# EAGLE design espism-v3 (EAGLE 6.5.0)
CNAME: An ISM to Wifi gateway; CREVISION: 3; DESIGNER: Johan Kanflo
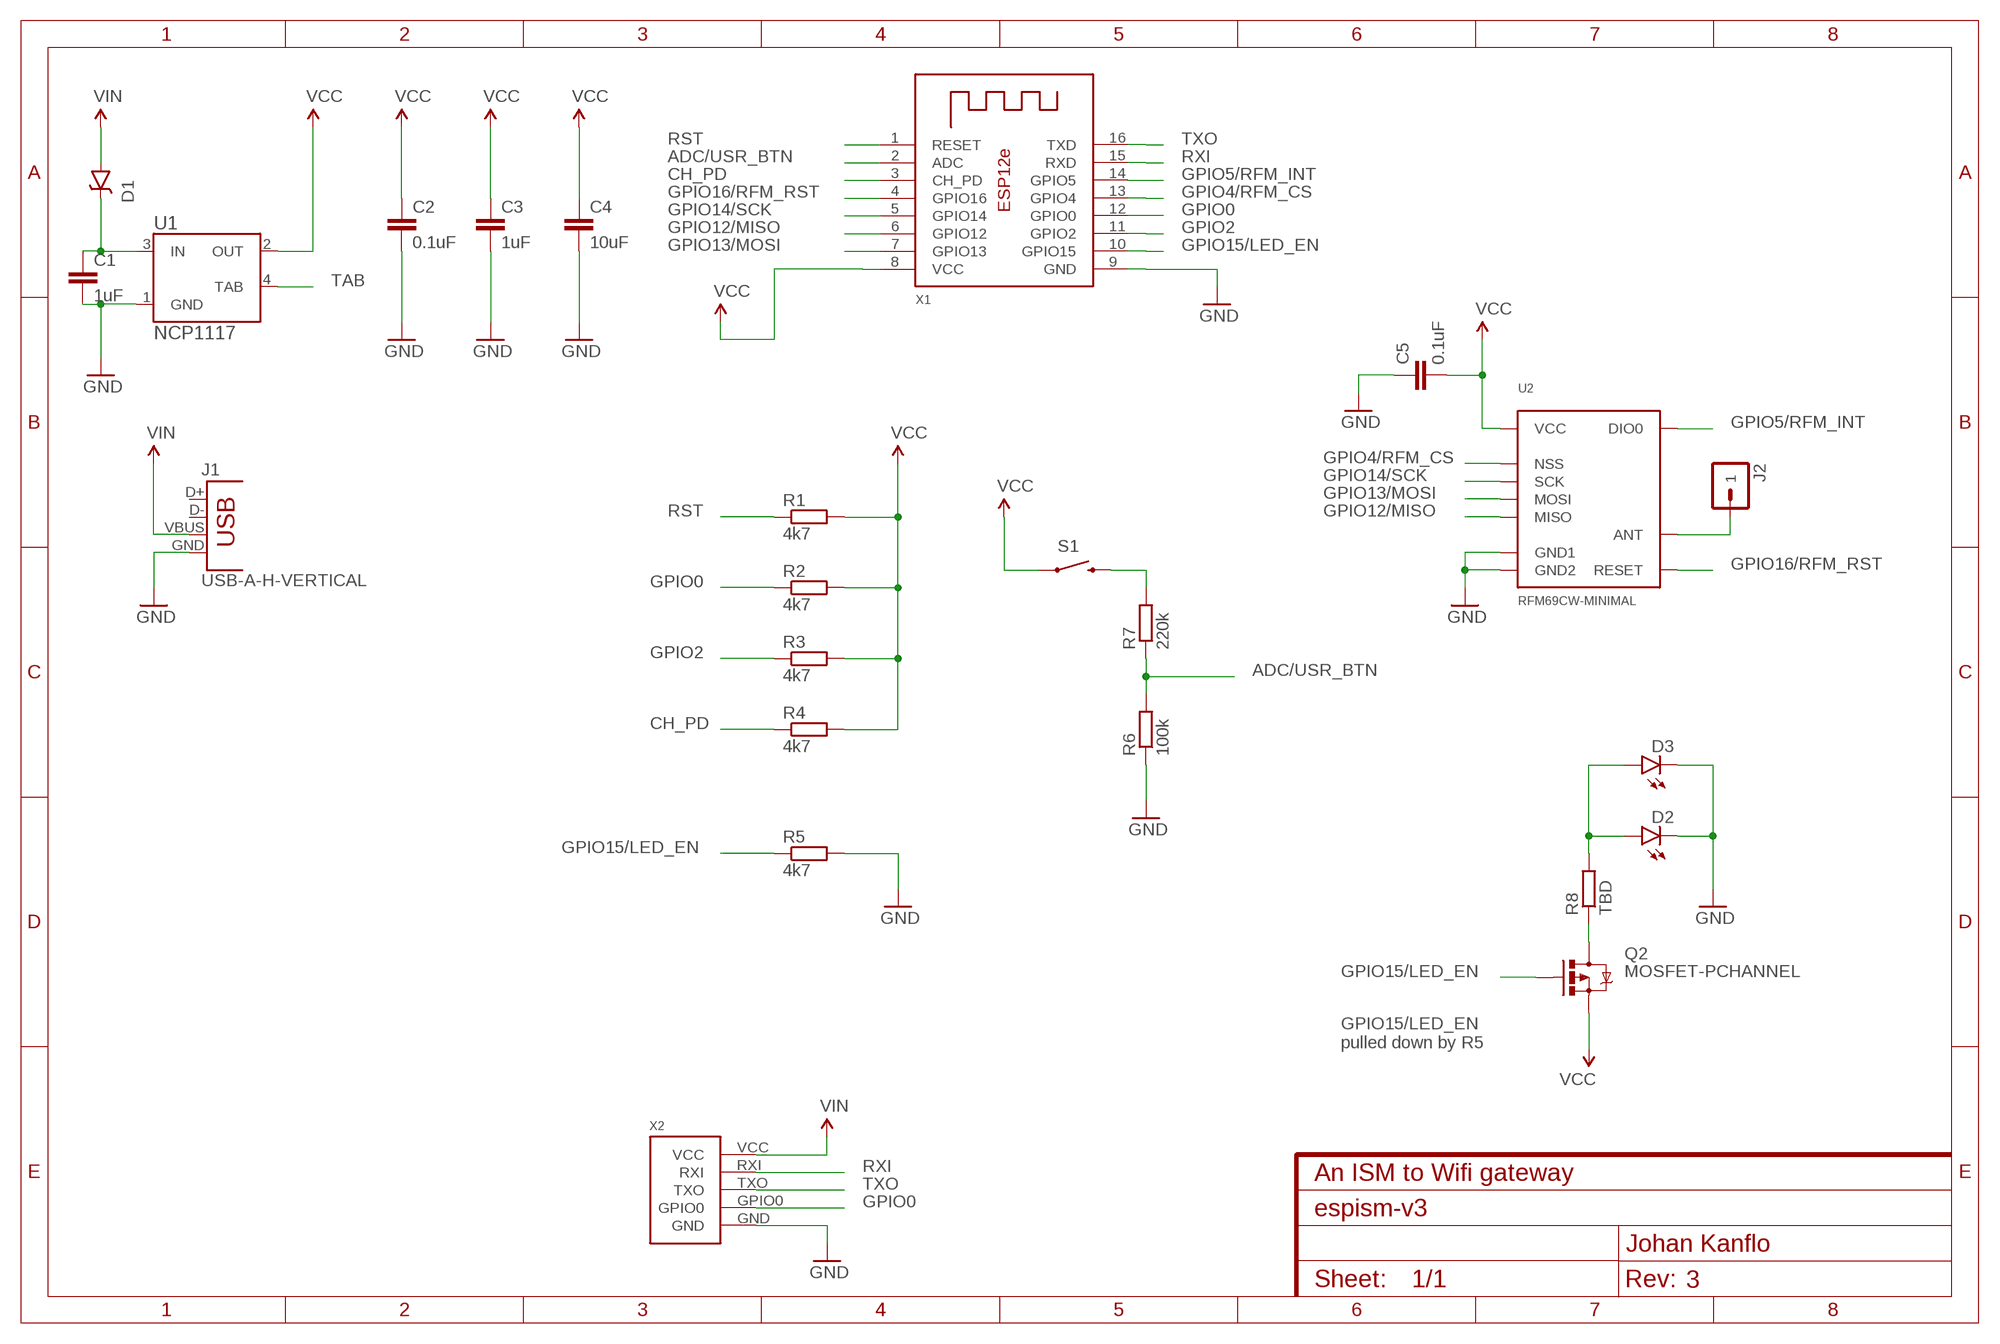
[diagram p0: schematic, sheet 1]

## Parts
C1  1uF  CAP0603-CAP  [0603-CAP]
C2  0.1uF  CAP0603-CAP  [0603-CAP]
C3  1uF  CAP0603-CAP  [0603-CAP]
C4  10uF  CAP0603-CAP  [0603-CAP]
C5  0.1uF  CAP0603-CAP  [0603-CAP]
D1  DIODE-SCHOTTKYSOD-123FL  [SOD-123FL]
D2  LED0603  [LED-0603]
D3  LED0603  [LED-0603]
J1  USB-A-H-VERTICAL  [USB-A-H-VERTICAL]
J2  M01-ANTENNA  [1X01-ANTENNA]
Q2  MOSFET-PCHANNEL  [SOT23-3]
R1  4k7  R-EU_R0603  [R0603]
R2  4k7  R-EU_R0603  [R0603]
R3  4k7  R-EU_R0603  [R0603]
R4  4k7  R-EU_R0603  [R0603]
R5  4k7  R-EU_R0603  [R0603]
R6  100k  R-EU_R0603  [R0603]
R7  220k  R-EU_R0603  [R0603]
R8  TBD  R-EU_R0603  [R0603]
S1  SWITCH-MOMENTARY-2SMD-1101NE  [TACTILE-SWITCH-1101NE]
U1  NCP1117  [SOT223]
U2  RFM69CW-MINIMAL  [RFM69CW-MINIMAL]
X1  ESP-12E  [ESP-12E]
X2  ESPROGESPROG-DEVICE  [ESPROG]

## Nets
ADC/USR_BTN: R6.2 R7.1 X1.2(ADC)
CAM_VCC: Q2.3(D) R8.1
CH_PD: R4.1 X1.3(CH_PD)
GND: C1.2 C2.2 C3.2 C4.2 C5.1 D2.C D3.C J1.GND R5.2 R6.1 U1.1(GND) U2.GND@1(GND1) U2.GND@2(GND2) X1.9(GND) X2.GND
GPIO0: R2.1 X1.12(GPIO0) X2.GPIO0
GPIO2: R3.1 X1.11(GPIO2)
GPIO4/RFM_CS: U2.NSS X1.13(GPIO4)
GPIO5/RFM_INT: U2.DIO0 X1.14(GPIO5)
GPIO12/MISO: U2.MISO X1.6(GPIO12)
GPIO13/MOSI: U2.MOSI X1.7(GPIO13)
GPIO14/SCK: U2.SCK X1.5(GPIO14)
GPIO15/LED_EN: Q2.1(G) R5.1 X1.10(GPIO15)
GPIO16/RFM_RST: U2.RESET X1.4(GPIO16)
N$1: D2.A D3.A R8.2
N$3: C1.1 D1.C U1.3(IN)
N$7: J2.1 U2.ANT
N$10: R7.2 S1.2
RST: R1.1 X1.1(RESET)
RXI: X1.15(RXD) X2.RXI
TAB: U1.4(TAB)
TXO: X1.16(TXD) X2.TXO
VCC: C2.1 C3.1 C4.1 C5.2 Q2.2(S) R1.2 R2.2 R3.2 R4.2 S1.1 U1.2(OUT) U2.VDD(VCC) X1.8(VCC)
VIN: D1.A J1.VBUS X2.VCC
Unconnected: J1.D+ J1.D-

## Notes on the sheet
- GPIO15/LED_EN
  pulled down by R5

## Library data of the parts
C1-C5 = SparkFun-Capacitors:CAP: Capacitor Standard 0603 ceramic capacitor, and 0.1" leaded capacitor.
D1 = kanflo:DIODE-SCHOTTKY
D2 D3 = SparkFun-LED:LED: LEDs Standard schematic elements and footprints for 5mm, 3mm, 1206, and 0603 sized LEDs. 5mm - Spark Fun Electronics SKU : COM-00529 (and others)
J1 = kanflo:USB: USB Connectors USB-A-H-VERTICAL a variant of SparkFun's USB-A-H (PRT-00437) that is mounted standing on the PCB. Bend the legs of the connector and solder in place. Solder header pins to the remaining holes to act as support for the connector.
J2 = kanflo:M01: Header 1 Standard 1-pin 0.1" header without silk screen.
Q2 = SparkFun-DiscreteSemi:MOSFET-PCHANNEL: Generic PMOSFET IRLML2244 - TRANS-11153 (SOT-23 -20V -4.3A) (1.Gate 2.Source 3.Drain) FQP27P06 - COM-10349 <http://www.sparkfun.com/products/10349> (TO-220 -60V -27A) (1.Gate 2.Source 3.Drain); PROD_ID: TRANS-08285
R1-R8 = resistor:R-EU_: RESISTOR, European symbol
S1 = SparkFun-Electromechanical:SWITCH-MOMENTARY-2: Various NO switches- pushbuttons, reed, etc; PROD_ID: SWCH-00815
U1 = ELL-i-PowerIC:NCP1117
U2 = kanflo:RFM69CW-MINIMAL: HopeRFs RFM69CW with all minimal IO.
X1 = kanflo:ESP-12E: ESP12e module This is a copy of AdaFruit's device with correct pin order for GPIO4 and GPIO5.
X2 = kanflo:ESPROG

## Board
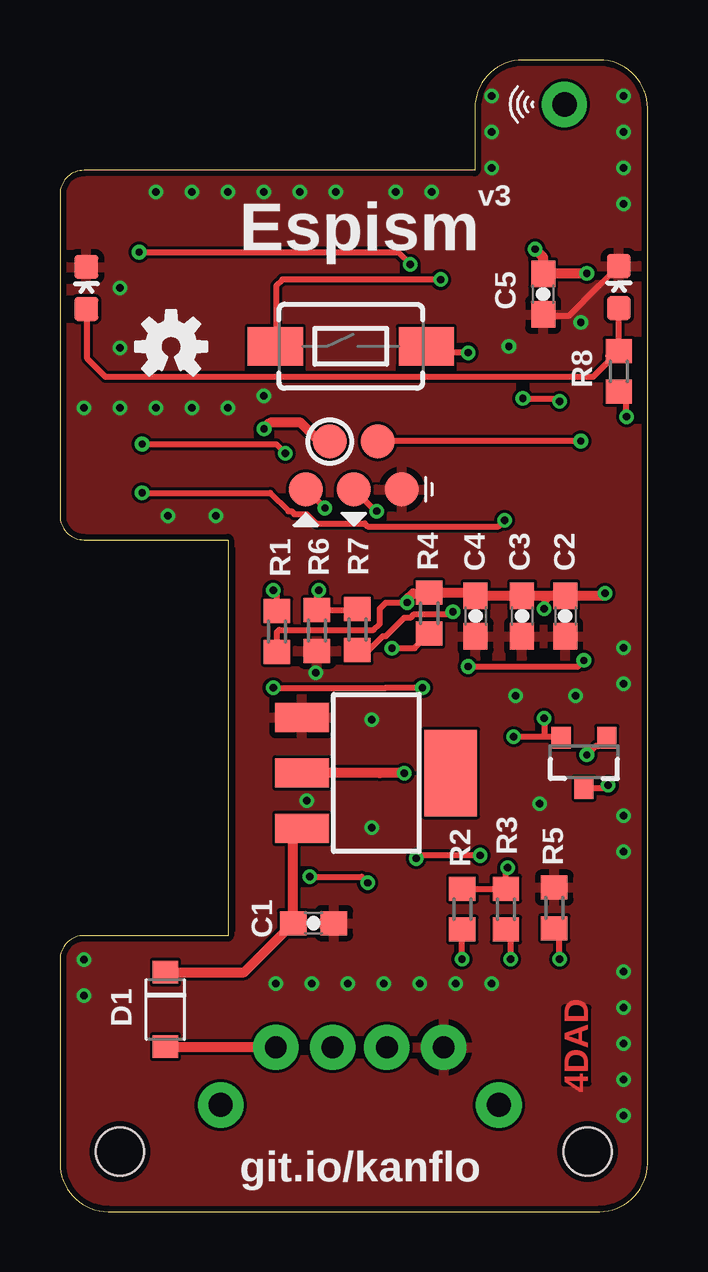
[diagram p1: board, top side]
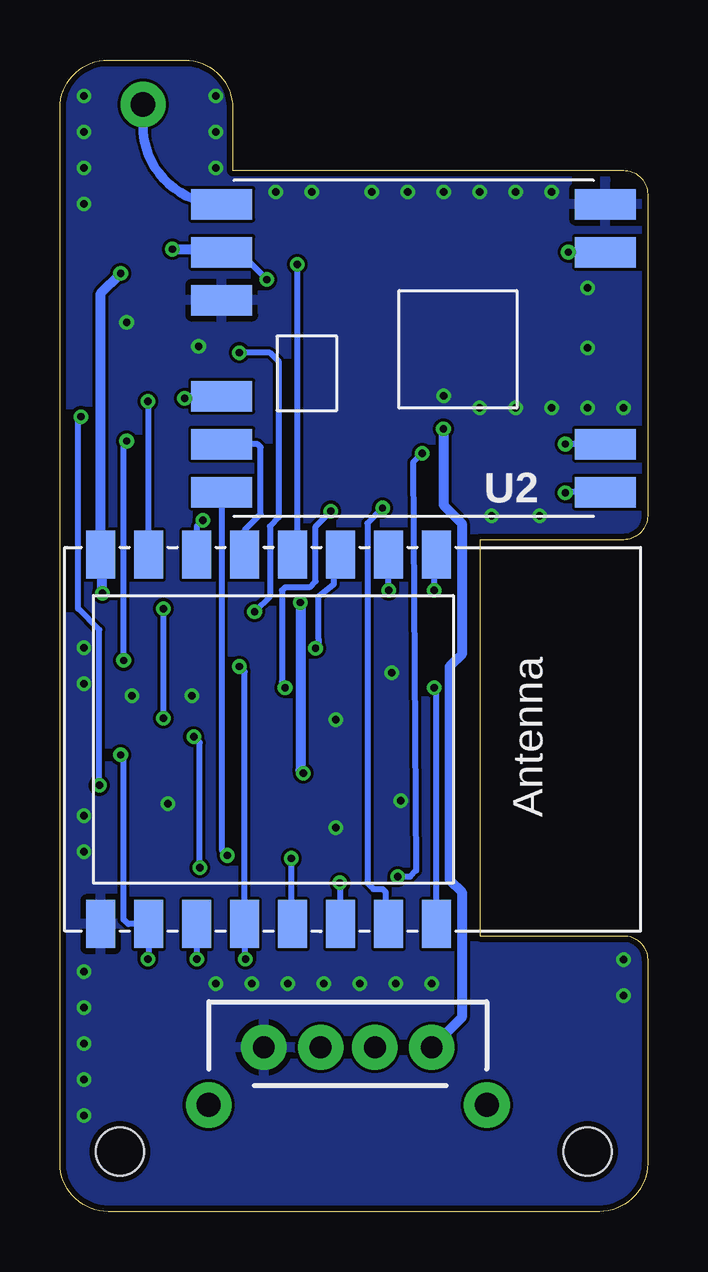
[diagram p2: board, bottom side, seen from below]

Size 24.5 x 48 mm. Coordinates in mm from the lower left corner, seen from the top.
Outline: 17.3,43.4 1,43.4 arc90 0,42.4 0,29 arc90 1,28 7,28 7,11.5 1,11.5 arc90 0,10.5 0,2 arc90 2,0 22.5,0 arc90 24.5,2 24.5,46 arc90 22.5,48 19.3,48 arc90 17.3,46 17.3,43.4
Copper layers (1*16): Top 0.035mm / dielectric 1.5mm / Bottom 0.035mm
Design rules "dirt_cheap_dirty_boards.v1": minimum track width 5mil, minimum drill 12mil, track to track 5mil, track to pad 5mil, pad to pad 5mil, via to via 5mil, smd to smd 0mil, copper to edge 10mil, drill to drill 10mil, minimum pad ring 10mil, minimum via ring 6mil, stop-mask expansion 2mil, vias tented up to drill 25mil, thermal gap 10mil
Holes 2 mm at 22,2.5 2.5,2.5

### Footprints (pad centres in the part's own frame; a part is rotated, then mirrored left to right if it is on the bottom)
0603-CAP = smd 1.1 x 1: 1 -0.85,0; 2 0.85,0
SOD-123FL = smd 0.95 x 1.05: A -1.6,0; C 1.5,0
LED-0603 = smd 1 x 1: A 0,-0.877; C 0,0.877
USB-A-H-VERTICAL = drill 0.914 pad 1.88: D+ 1.24,1.127; D- 1.24,-1.127; GND 1.24,3.5; VBUS 1.24,-3.5 | drill 1 pad 1.9: GND2 -1.16,-5.8; GND3 -1.16,5.8
1X01-ANTENNA = drill 1.016 pad 1.88: 1 0,0
SOT23-3 = smd 0.8 x 0.9: 1 -0.95,-1; 2 0.95,-1; 3 0,1.1
R0603 = smd 1 x 1.1: 1 -0.85,0; 2 0.85,0
TACTILE-SWITCH-1101NE = smd 2.3 x 1.6: 1 -3.15,0; 2 3.15,0
SOT223 = smd 1.219 x 2.235: 1 -2.311,-3.099; 2 0,-3.099; 3 2.311,-3.099 | smd 3.6 x 2.2: 4 0,3.099
RFM69CW-MINIMAL = smd 2.54 x 1.27: ANT 10.9,-6.1; DIO0 -5.1,3.9; GND@1 10.9,-2.1; GND@2 -5.1,-6.1; MISO -5.1,5.9; MOSI 10.9,1.9; NSS 10.9,5.9; RESET -5.1,-4.1; SCK 10.9,3.9; VDD 10.9,-4.1
ESP-12E = smd 2 x 1.2: 1 -7.7,4.5; 2 -7.7,2.5; 3 -7.7,0.5; 4 -7.7,-1.5; 5 -7.7,-3.5; 6 -7.7,-5.5; 7 -7.7,-7.5; 8 -7.7,-9.5; 9 7.7,-9.5; 10 7.7,-7.5; 11 7.7,-5.5; 12 7.7,-3.5; 13 7.7,-1.5; 14 7.7,0.5; 15 7.7,2.5; 16 7.7,4.5
ESPROG = smd 1.422 x 1.422: GND -1,-2; GPIO0 1,-1; RXI -1,2; TXO -1,0; VCC 1,1

### Placement (x,y rotation side)
C1  10.57,12.02 0 top
C2  21.07,24.82 270 top
C3  19.26,24.82 270 top
C4  17.32,24.82 270 top
C5  20.16,38.24 90 top
D1  4.39,8.48 90 top
D2  23.3,38.53 0 top
D3  1.1,38.5 0 top
J1  12.5,5.6 90 bottom
J2  21.04,46.15 135 top
Q2  21.85,18.75 180 top
R1  9.05,24.18 270 top
R2  16.78,12.6 90 top
R3  18.59,12.6 90 top
R4  15.39,24.94 90 top
R5  20.61,12.66 90 top
R6  10.72,24.22 90 top
R7  12.4,24.26 270 top
R8  23.3,35.02 90 top
S1  12.12,36.06 0 top
U1  13.19,18.28 270 top
U2  6.86,35.89 180 bottom
U$2  [OSHW-LOGO-S]  4.64,36.06 0 top
X1  13.3,19.68 270 bottom
X2  12.25,31.1 90 top

### Tracks (layer width: path | path; a pad name or v marks a point on that pad's centre or on a via)
ADC/USR_BTN  (via drill 0.3 pad 0.25)
  Top 0.254: v10.79,25.89 10.72,25.81 R6.2 12.36,25.07 R7.1
  Bottom 0.254: v10.79,25.89 X1.2
CAM_VCC  (via drill 0.3 pad 0.25)
  Top 0.254: Q2.3 22.75,17.65 v22.86,17.77 | v23.62,33.13 23.62,33.85 R8.1
  Bottom 0.254: v22.86,17.77 22.86,24.24 23.75,25.13 23.75,33.01 v23.62,33.13
CH_PD  (via drill 0.3 pad 0.25)
  Top 0.254: 14.99,23.86 14.99,24.24 15.13,24.09 R4.1 14.78,23.48 v13.84,23.48
  Bottom 0.254: X1.3 13.08,27.1 13.08,26.15 13.72,25.64 13.72,23.86 13.72,23.61 v13.84,23.48
GND  (via drill 0.3 pad 0.25, 0.3 pad 0.61)
  Top 0.254: D2.C 22.48,38.59 21.21,37.32 20.22,37.32 C5.1
  other vias: 10.29,17.13 21.72,37.07 10.67,22.46 4,42.5 5.5,42.5 7,42.5 10,42.5 1,33.5 11.5,42.5 14,42.5 15.5,42.5 18,45 18,43.5 23.5,43.5 23.5,45 23.5,46.5 18,46.5 23.5,42 23.5,23.5 23.5,22 23.5,16.5 23.5,15 23.5,10 23.5,8.5 23.5,7 23.5,5.5 23.5,4 1,9 1,10.5 9,9.5 10.5,9.5 12,9.5 13.5,9.5 15,9.5 16.5,9.5 18,9.5 13,16 13,20.5 19,21.5 20,17 21.5,21.5 2.5,33.5 4,33.5 5.5,33.5 7,33.5 8.5,34 2.5,36 2.5,38.5 18.72,36.07 4.5,29 6.5,29 8.5,42.5
  pour Bottom (rank 6): 0,48.04 24.51,48.04 24.51,-0.01 0,-0.01
  pour Top (rank 6): 0,48.04 24.51,48.04 24.51,-0.01 0,-0.01
GPIO0  (via drill 0.3 pad 0.25)
  Top 0.254: v16.76,10.53 16.76,11.74 R2.1 | v17.02,22.72 21.59,22.72 v21.84,22.97 | v21.72,32.12 13.27,32.12 X2.GPIO0
  Bottom 0.254: v16.76,10.53 16.8,10.56 X1.12 16.8,22.5 v17.02,22.72 | v21.84,22.97 21.84,31.86 v21.72,32.12
GPIO2  (via drill 0.3 pad 0.25)
  Top 0.254: v18.8,10.53 18.8,11.55 R3.1
  Bottom 0.254: X1.11 v18.8,10.53
GPIO4/RFM_CS  (via drill 0.3 pad 0.25)
  Top 0.254: v17.53,14.84 14.99,14.84 v14.86,14.72
  Bottom 0.254: U2.NSS 17.76,15.07 v17.53,14.84 | v14.86,14.72 14.86,12.04 X1.13
GPIO5/RFM_INT  (via drill 0.3 pad 0.25)
  Top 0.254: v3.43,31.99 9.02,31.99 v9.4,31.61 | v10.41,13.95 12.57,13.95 v12.83,13.7
  Bottom 0.254: U2.DIO0 v3.43,31.99 | v9.4,31.61 9.78,31.23 9.65,14.21 9.91,13.95 v10.41,13.95 | v12.83,13.7 12.83,12.01 X1.14
GPIO12/MISO  (via drill 0.3 pad 0.25)
  Top 0.254: v18.54,28.81 18.29,28.56 12.83,28.56 12.7,28.69 10.67,28.69 10.54,28.81 10.29,29.07 9.78,29.07 9.65,29.2 9.53,29.2 8.76,29.96 v3.43,29.96
  Bottom 0.254: U2.MISO 2.76,29.99 3.4,29.99 v3.43,29.96 | v18.54,28.81 18.8,28.56 18.8,28.05 X1.6
GPIO13/MOSI  (via drill 0.3 pad 0.25)
  Top 0.254: v19.3,33.89 20.7,33.89 v20.83,33.77
  Bottom 0.254: U2.MOSI 19.21,33.99 v19.3,33.89 | v20.83,33.77 20.83,27.41 X1.7
GPIO14/SCK
  Bottom 0.254: X1.5 16.8,28.4 16.13,29.07 16.13,31.86 16.26,31.99 U2.SCK
GPIO15/LED_EN  (via drill 0.3 pad 0.25)
  Top 0.254: v20.83,10.53 20.83,11.59 R5.1 | v21.97,19.04 22.23,19.29 22.35,19.42 22.46,19.42 Q2.1
  Bottom 0.254: v20.83,10.53 20.8,10.55 X1.10 21.65,11.98 21.84,12.18 21.84,18.91 v21.97,19.04
GPIO16/RFM_RST  (via drill 0.3 pad 0.25)
  Top 0.254: v3.3,39.99 14.1,39.99 v14.61,39.48
  Bottom 0.254: U2.RESET v3.3,39.99 | v14.61,39.48 14.61,27.58 X1.4
N$1
  Top 0.254: D2.A R8.2 23.06,35.87 22.86,35.67 22.86,35.42 22.23,34.78 1.91,34.78 1.14,35.55 1.14,37.58 | 1.14,37.58 D3.A 1.14,37.58
N$3
  Top 0.406: D1.C 7.69,9.98 C1.1 9.72,15.6 U1.3
N$7
  Bottom 0.4: U2.ANT arc90 21.04,45.27 J2.1
N$10  (via drill 0.3 pad 0.25)
  Top 0.254: v16.38,25 16.26,24.88 14.73,24.88 14.61,24.75 14.35,24.75 13.59,23.99 13.46,23.99 12.88,23.41 R7.2 | v17.02,35.8 15.54,35.8 S1.2
  Bottom 0.254: v16.38,25 15.75,25.64 15.75,28.56 15.37,28.94 15.37,35.42 15.75,35.8 v17.02,35.8
RST  (via drill 0.3 pad 0.25)
  Top 0.254: R1.1 9.05,25.73 v8.89,25.89
  Bottom 0.254: v8.89,25.89 8.89,27.29 X1.1
RXI  (via drill 0.3 pad 0.25)
  Top 0.254: X2.RXI 10.28,30.1 v11.05,29.32
  Bottom 0.254: v11.05,29.32 11.68,28.69 11.68,13.7 11.43,13.45 11.05,13.45 10.92,13.32 10.92,12.1 X1.15
TXO  (via drill 0.3 pad 0.25)
  Top 0.254: v8.89,21.83 13.59,21.83 v15.11,21.83 | v13.21,29.2 13.15,29.2 X2.TXO
  Bottom 0.254: X1.16 8.8,21.74 v8.89,21.83 | v13.21,29.2 13.84,28.56 13.84,26.27 14.1,26.02 15.11,26.02 15.24,25.89 15.24,22.08 v15.11,21.83
VCC  (via drill 0.3 pad 0.25)
  Top 0.254: R2.2 R3.2 18.59,14.26 v18.67,14.34 | v18.92,19.8 20.19,19.8 | 20.19,19.8 20.85,19.8 Q2.2 | 21.34,25.38 21.08,25.38 20.7,25.77 20.57,25.77 20.19,25.38 v20.19,25.13 | v20.19,20.56 20.19,19.8 | v14.48,25.38 13.59,25.38 13.34,25.13 13.34,24.5 13.08,24.24 9.14,24.24 9.05,24.15 R1.2 | v15.88,38.85 9.27,38.85 9.02,38.59 9.02,36.11 S1.1
  Top 0.406: C2.1 C3.1 C4.1 17.21,25.79 R4.2 | C2.1 21.07,25.65 21.34,25.38 | 15.37,25.77 R4.2 | v21.97,39.1 C5.2 20.16,39.77 v19.81,40.12 | C2.1 22.64,25.67 v22.73,25.77 | U1.2 13.34,18.27 v14.35,18.27 | v14.48,25.38 14.48,25.51 14.73,25.77 15.37,25.77 | 15.37,25.77 R4.2
  Bottom 0.254: v18.67,14.34 18.67,19.54 v18.92,19.8 | v20.19,25.13 v20.19,20.56 | U2.VDD 17.02,39.99 v15.88,38.85
  Bottom 0.406: v21.97,39.1 22.8,38.27 X1.8 22.73,27.31 v22.73,25.77 | v19.81,40.12 17.89,40.12 U2.VDD | v14.48,25.38 14.48,18.4 v14.35,18.27
VIN  (via drill 0.3 pad 0.25)
  Top 0.406: J1.VBUS 4.43,6.84 D1.A | X2.VCC 10.81,32.1 10.03,32.88 8.76,32.88 v8.51,32.62
  Bottom 0.406: v8.51,32.62 8.51,29.45 7.75,28.69 7.75,23.23 8.26,22.72 8.26,13.83 7.75,13.32 7.75,8.09 J1.VBUS

### Text on the board
Top: 4DAD
tNames: v3 | Espism | git.io/kanflo